# EAGLE schematic Camera Board (EAGLE 9.4.2)
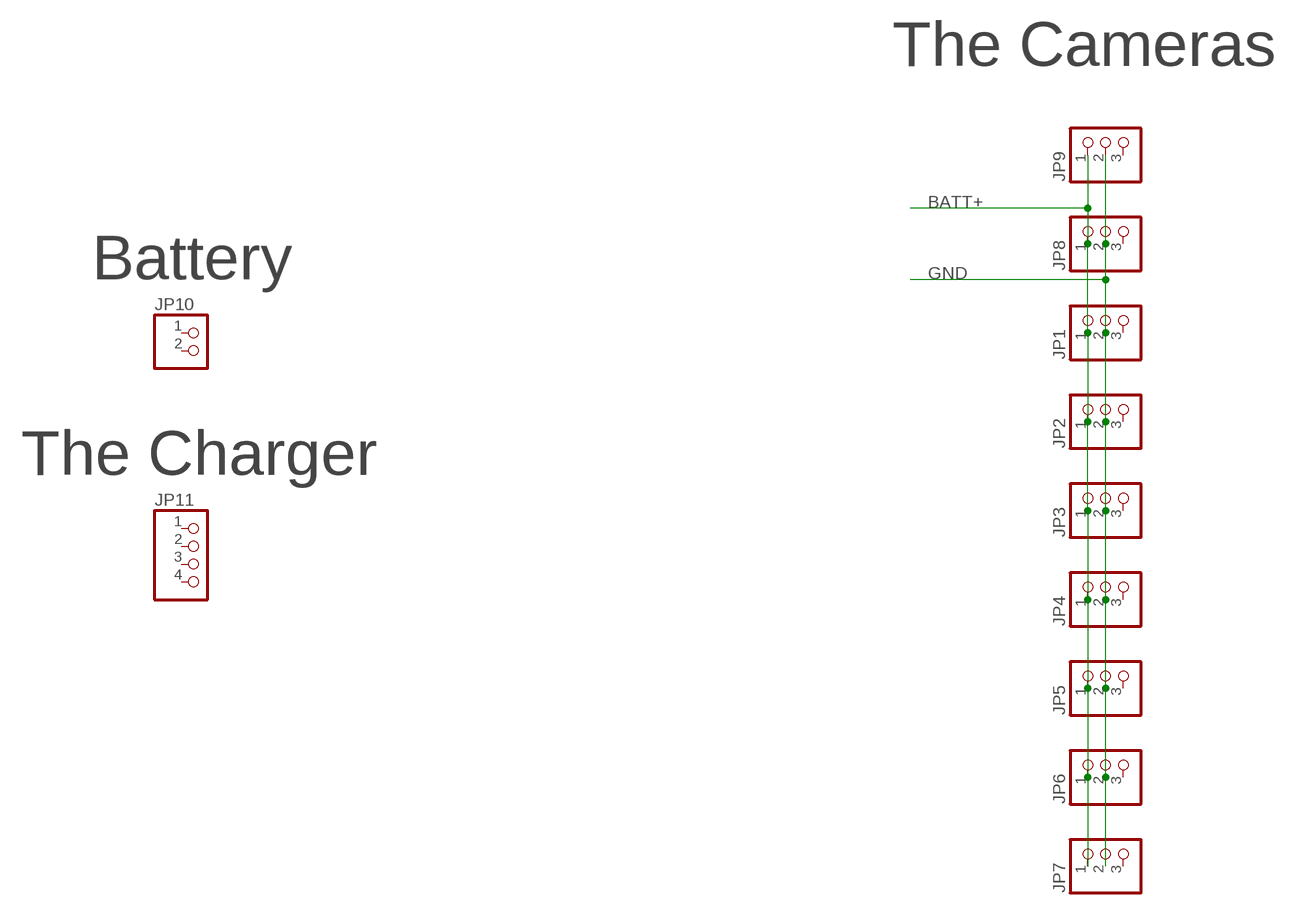
[diagram p0: schematic, sheet 1]

## Parts
JP1  PINHD-1X3  [1X03]
JP2  PINHD-1X3  [1X03]
JP3  PINHD-1X3  [1X03]
JP4  PINHD-1X3  [1X03]
JP5  PINHD-1X3  [1X03]
JP6  PINHD-1X3  [1X03]
JP7  PINHD-1X3  [1X03]
JP8  PINHD-1X3  [1X03]
JP9  PINHD-1X3  [1X03]
JP10  PINHD-1X2  [1X02]
JP11  PINHD-1X4  [1X04]

## Nets
BATT+: JP1.1 JP2.1 JP3.1 JP4.1 JP5.1 JP6.1 JP7.1 JP8.1 JP9.1
GND: JP1.2 JP2.2 JP3.2 JP4.2 JP5.2 JP6.2 JP7.2 JP8.2 JP9.2
Unconnected: JP1.3 JP2.3 JP3.3 JP4.3 JP5.3 JP6.3 JP7.3 JP8.3 JP9.3 JP10.1 JP10.2 JP11.1 JP11.2 JP11.3 JP11.4

## Notes on the sheet
- The Cameras
- Battery
- The Charger

## Library data of the parts
JP1-JP9 = pinhead:PINHD-1X3: PIN HEADER
JP10 = pinhead:PINHD-1X2: PIN HEADER
JP11 = pinhead:PINHD-1X4: PIN HEADER